# Altium schematic sheet Esquematico_TSAL_controladora.SchDoc
size A4; SheetNumber: 1; SheetTotal: 1; SPICEModelCacheHZPJKXFX: <root> / <DocumentId>HZPJKXFX</DocumentId> / <CacheFrame Number="0"> / <Model Name="zener" Kind="MDL"> / <Text>*ZENER / *Default Zener 10V @ 10mA / *Zener Diode Pinout: A,K / .MODEL ZENER D( BV=10 IBV=10E-3 )</Text> / </Model> / <Model Name="10tq035" Kind="MDL"> / <Text>*10TQ035 MCE 3/26/98 / *Ref: IR Power Semiconductors Product Digest '94 / *MCE 35V 10A 3us pkg:TO-220 3,1 / .MODEL 10TQ035 D (IS=14.2N RS=4.2M N=1.7 BV=35 IBV=15M / + CJO=412P VJ=0.75 M=0.333 TT=4.32U EG=.69 XTI=2)</Text> / </Model> / </CacheFrame> / </root>
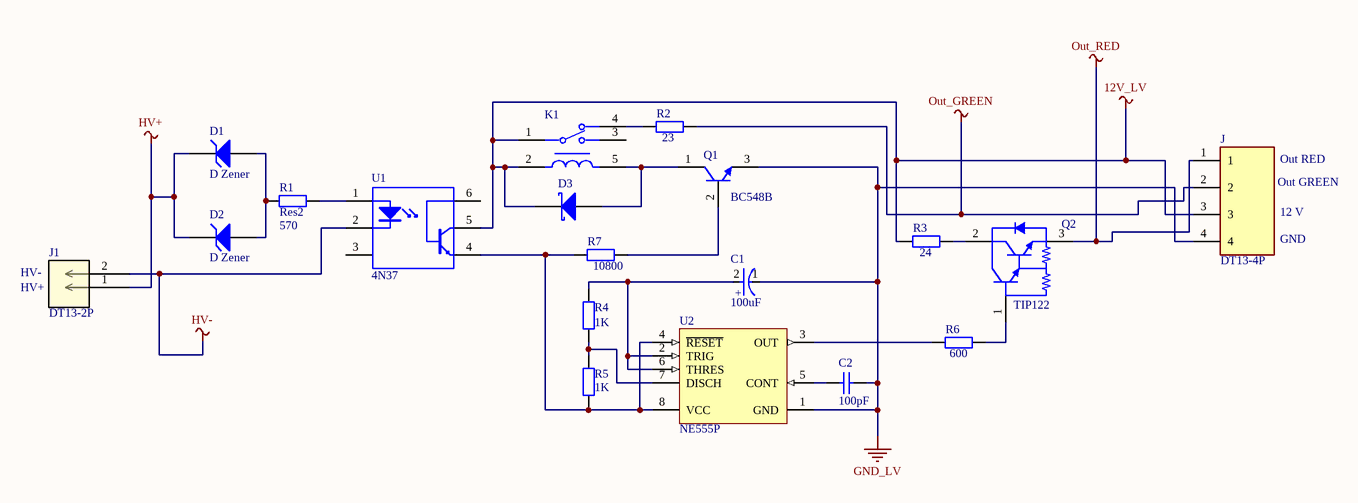
[diagram p0: Esquematico_TSAL_controladora.SchDoc]

## Parts
C1  Capacitance: 100uF  [FP-UKL1A101KED1TD-MFG]  (hidden comment: UKL1A101KED1TD)
C2  value 100pF  [RAD-0.3]  (hidden comment: Cap)
D1  D Zener  [DIODE-0.7]
D2  D Zener  [DIODE-0.7]
D3  Diode 10TQ035  [TO-220AC]  (value not drawn)
J  DT13-4P  [TE_DT13-4P]
J1  DT13-2P  [CONN2_DT13-2P_TEC]
K1  G5LE-14-CF-36 DC12  [FP-G5LE-14-CF-36_DC12-MFG]  (value not drawn)
Q1  BC548B  [ONSC-TO-92-3-29-11]
Q2  TIP122  [ONSC-TO-220-3-221A-09]
R1  Res2  value 570  [AXIAL-0.4]
R2  value 23  [AXIAL-0.4]  (hidden comment: Res2)
R3  value 24  [AXIAL-0.4]  (hidden comment: Res2)
R4  value 1K  [AXIAL-0.4]  (hidden comment: Res2)
R5  value 1K  [AXIAL-0.4]  (hidden comment: Res2)
R6  value 600  [AXIAL-0.4]  (hidden comment: Res2)
R7  value 10800  [AXIAL-0.4]  (hidden comment: Res2)
U1  4N37  [LTST-DIP-6_A]
U2  NE555P  [P0008A]

## Nets
12V_LV: D3.1(K) J.3 K1.1 K1.2 R3.1 U1.5(C)
GND_LV: C1.1(C) C2.2 J.4 Q1.3(E) U2.1(GND)
HV+: D1.2(K) D2.2(K) J1.1
HV-: J1.2 U1.2(C)
Out_GREEN: J.2 R2.2
Out_RED: J.1 Q2.3(E)
NetC1_2: C1.2(A) R4.2 U2.2(TRIG) U2.6(THRES)
NetC2_1: C2.1 U2.5(CONT)
NetD1_1: D1.1(A) D2.1(A) R1.1
NetD3_3: D3.3(A) K1.5 Q1.1(C)
NetK1_4: K1.4 R2.1
NetQ1_2: Q1.2(B) R7.2
NetQ2_1: Q2.1(B) R6.2
NetQ2_2: Q2.2(C) R3.2
NetR1_2: R1.2 U1.1(A)
NetR4_1: R4.1 R5.2 U2.7(DISCH)
NetR5_1: R5.1 R7.1 U1.4(E) U2.4(~{RESET}) U2.8(VCC)
NetR6_1: R6.1 U2.3(OUT)

Not connected (* = marked no-connect by the designer): K1 3; U1 3(NC) 6(B)

## Notes on the sheet
- Out GREEN
- Out RED
- 12 V
- GND
- (near J1) HV+
- (near J1) HV-
- (in symbol CMP-12462-000006-1) +

## Library data of the parts
C1 = CMP-12462-000006-1: CAP ALUM 100UF 10% 10V RADIAL; Manufacturer: Nichicon; Dissipation Factor: 15%; Life: 2000Hours; Ripple Current: 180mA; Material: Aluminum; Leakage Current: 2uA; ComponentLink2Description: Datasheet; Value: 100uF; Digikey Description: CAP ALUM 100UF 10% 10V RADIAL; Temperature Range High: +85°C; RoHS: TRUE; Tolerance: 10%; Category: Cap; Device Class L1: Passive Components; Device Class L2: Capacitors; Package: 0; Height: 12mm; Octopart: https://octopart.com/ukl1a101ked1td-nichicon-20309866; Temperature: -40°C to +85°C; Temperature Range Low: -40°C; Lead Free: Yes; Voltage Rating: 10V; Manufacturer Part Number: UKL1A101KED1TD; Device Class L3: Aluminum Electrolytic Capacitors; ComponentLink2URL: https://www.nichicon.co.jp/english/products/pdfs/e-ukl.pdf; Automotive: No
C2 = Cap: Capacitor; Published: 8-Jun-2000; LatestRevisionDate: 17-Jul-2002; LatestRevisionNote: Re-released for DXP Platform.; PackageReference: RAD-0.3; Publisher: Altium Limited; PackageDescription: Radial Cap, Thru-Hole; 2 Leads; 0.3 in Pin Spacing
D1 D2 = D Zener: Zener Diode; Published: 8-Jun-2000; LatestRevisionDate: 17-Jul-2002; LatestRevisionNote: Re-released for DXP Platform.; PackageReference: DIODE-0.7; Publisher: Altium Limited; PackageDescription: Diode, Thru-Hole; 2 Leads; 0.7 in Pin Spacing
D3 = Diode 10TQ035: Schottky Rectifier; Note: Terminal 2 is the TAB and is electrically connected to the cathode; Published: 8-Jun-2000; LatestRevisionDate: 17-Jul-2002; LatestRevisionNote: Re-released for DXP Platform.; DatasheetVersion: PD-2.057B; PackageVersion: Feb-1998; PackageReference: TO-220AC; Publisher: Altium Limited; PackageDescription: TO, Thru-Hole, Vertical, Heatsink Mounted; 3 In-Line Leads (1 Absent); Pitch 2.54 mm; ComponentLink1Description: Manufacturer Link; ComponentLink1URL: http://www.irf.com/; ComponentLink2Description: Datasheet; ComponentLink2URL: http://www.irf.com/product-info/datasheets/data/10tq.pdf
J = DT13-4P: DT13 Series, 4.44mm Pitch 4 Way 2 Row Right Angle PCB Header, Solder Termination; MF: TE Connectivity; SnapEDA_Link: https://www.snapeda.com/parts/DT13-4P/TE%20Connectivity%20Deutsch%20Connectors/view-part/2708791/?ref=snap; MP: DT13-4P; TE_purchase_URL: https://www.te.com/usa-en/product-DT13-4P.html?te_bu=Cor&te_type=disp&te_campaign=seda_glo_cor-seda-global-disp-prtnr-fy19-seda-model-bom-cta_sma-317_1&elqCampaignId=32493; Availability: Unavailable; Value: *; Price: None; Package: None
J1 = DT13-2P: No Description Available; Mfr_Name: TE Connectivity; TYPE: -; RefDes: RefDes
K1 = CMP-08822-000100-1: RELAY GEN PURPOSE; Power Consumption: 360mW; Max Voltage Rating (AC): 250V; Coil Voltage (DC): 12V; Coil Resistance: 400R; Release Time: 5ms; Relay Type: General Purpose; Throw Configuration: SPDT; Max Current Rating: 10A; Operate Time: 10ms; Coil Type: Non-Latching; Max Voltage Rating (DC): 125V; Coil Current: 30mA; Contact Material: Tin; Mount: Through Hole; Packaging: Bulk; Max Operating Temperature: 85°C; Package Quantity: 100; Radiation Hardening: No; Weight: 0.423288oz; Coil Power: 360mW; Min Operating Temperature: -40°C; Termination: PC Pin; Contact Current Rating: 10A; Length: 22.5mm; Width: 15.6mm; Height: 19mm
Q1 = CMP-1048-01456-1: Amplifier Transistor, NPN Silicon, 3-Pin TO-92, Bulk Box; Manufacturer: On Semiconductor; IC Continuous (A): 0.1; fT Min (MHz): 150; Mounting Technology: Through Hole; ComponentLink3Description: Package Specification; Polarity: NPN; ComponentLink3URL: http://www.onsemi.cn/pub_link/Collateral/2N6426-D.PDF; PartNumber: BC548B; ComponentLink2Description: Datasheet; ComponentLink1Description: Manufacturer URL; ComponentLink2URL: http://www.onsemi.com/pub_link/Collateral/BC546-D.PDF; PackageReference: TO-92-3-29-11_AM_SL; DatasheetVersion: Rev. 7; PackageDescription: 3-Pin Transistor Outline, Body 4.825 x 3.685 mm, Pitch 1.27 mm; PackageVersion: Rev. AM; Packing: Bulk Box; RoHS: FALSE; ComponentLink1URL: http://www.onsemi.com/
Q2 = CMP-1047-00126-1: Plastic Medium-Power, Complementary Silicon Transistor, 3-Pin TO-220, Tube; Manufacturer: On Semiconductor; IC Continuous (A): 5; Polarity: NPN; PackageDescription: 3-Pin Flange Mount, Vertical Straight Lead, Body 9.97 x 4.445 mm, Pitch 2.54 mm; DatasheetVersion: Rev. 8; PartNumber: TIP122; ComponentLink1Description: Manufacturer URL; ComponentLink3Description: Package Specification; PackageReference: TO-220-3-221A-09; Mounting Technology: Through Hole; PackageVersion: Rev. AG, 09/2011; RoHS: FALSE; ComponentLink2Description: Datasheet; ComponentLink2URL: http://www.onsemi.cn/pub_link/Collateral/TIP120-D.PDF; ComponentLink3URL: http://www.onsemi.com/pub_link/Collateral/221A-09.PDF; ComponentLink1URL: http://www.onsemi.com/; Packing: Tube
R1-R7 = Res2: Resistor; Published: 8-Jun-2000; LatestRevisionDate: 17-Jul-2002; LatestRevisionNote: Re-released for DXP Platform.; PackageReference: AXIAL-0.4; Publisher: Altium Limited; PackageDescription: Axial Device, Thru-Hole; 2 Leads; 0.4 in Pin Spacing
U1 = CMP-2000-05615-1: Photocoupler - Phototransistor Output, 1500 Vrms, -55 to 100 degC, 6-Pin DIP, RoHS, Tube; Manufacturer: Vishay; Maximum Input Diode Current: 60mA; Output Type: DC; Maximum Collector Current: 100mA; Isolation Voltage: 5000Vrms; Maximum Power Dissipation: 70mW; Maximum Reverse Diode Voltage: 6V; Current Transfer Ratio: 50%; Number of Channels: 1Channel; Output Device: NPNPhototransistor; Brand: VishaySemiconductors; Maximum Forward Diode Voltage: 1.5V; Maximum Collector Emitter Voltage: 30V; RoHS: Details; Package Description: 6-Pin Double In-line Package, Body 7.3 x 6.5 mm, Pitch 2.54 mm; Product Category: TransistorOutputOptocouplers; Packaging: Tube; Manufacturer URL: http://www.us.liteon.com/; Minimum Operating Temperature: -55C; Package Reference: DIP-6; Input Type: DC; Datasheet Version: Rev. D, 12/2015; Datasheet URL: http://optoelectronics.liteon.com/upload/download/DS-70-99-0012/S_110_4N3X%20Series%201115.pdf; Maximum Operating Temperature: +100C; Package / Case: PDIP-6; Forward Current: 60mA; Configuration: 1Channel; Factory Pack Quantity: 3000; Number of Channels per Chip: 1Channel; Mounting Technology: ThroughHole
U2 = CMP-2000-04954-1: Precision Timer, 4.5 to 16 V, 0 to 70 degC, 8-Pin DIP, Pb-Free, Tube; Manufacturer: TexasInstruments; Maximum High Level Output Current: -200mA; Number of Internal Timers: 1; Operating Supply Voltage: 5; Maximum Low Level Output Current: 200mA; Rad Hard: No; Packaging: Rail/Tube; Manufacturer URL: http://www.ti.com/; Package Reference: P8; Package Description: 8-Pin Double In-line Package, Body 9.59 x 6.35 mm, Pitch 2.54 mm; Package URL: http://www.ti.com/lit/ml/mpdi001b/mpdi001b.pdf; Type: Standard; Datasheet URL: http://www.ti.com/general/docs/lit/getliterature.tsp?genericPartNumber=NE555&fileType=pdf; Category: Timer; Package: 8PDIP; Datasheet Version: Rev. I, 09/2014